# Altium schematic sheet WiFi.SchDoc
size A4
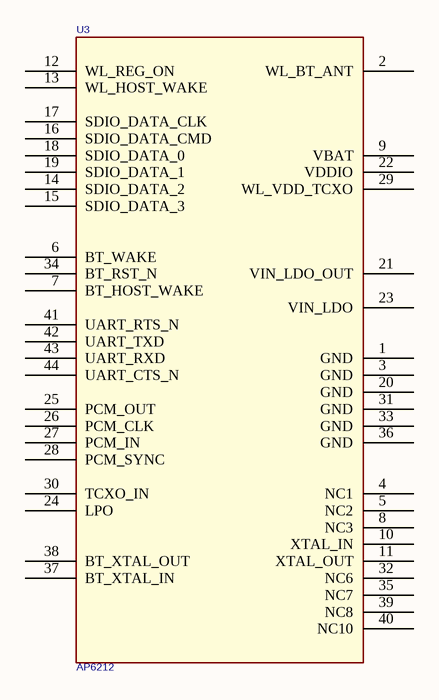
[diagram p0: WiFi.SchDoc]

## Parts
U3  AP6212  [AP6212]

## Nets

Not connected (* = marked no-connect by the designer): U3 1(GND) 2(WL_BT_ANT) 3(GND) 4(NC1) 5(NC2) 6(BT_WAKE) 7(BT_HOST_WAKE) 8(NC3) 9(VBAT) 10(XTAL_IN) 11(XTAL_OUT) 12(WL_REG_ON) 13(WL_HOST_WAKE) 14(SDIO_DATA_2) 15(SDIO_DATA_3) 16(SDIO_DATA_CMD) 17(SDIO_DATA_CLK) 18(SDIO_DATA_0) 19(SDIO_DATA_1) 20(GND) 21(VIN_LDO_OUT) 22(VDDIO) 23(VIN_LDO) 24(LPO) 25(PCM_OUT) 26(PCM_CLK) 27(PCM_IN) 28(PCM_SYNC) 29(WL_VDD_TCXO) 30(TCXO_IN) 31(GND) 32(NC6) 33(GND) 34(BT_RST_N) 35(NC7) 36(GND) 37(BT_XTAL_IN) 38(BT_XTAL_OUT) 39(NC8) 40(NC10) 41(UART_RTS_N) 42(UART_TXD) 43(UART_RXD) 44(UART_CTS_N)

## Library data of the parts
U3 = AP6212: ORCAD_LIB: MODULE; QVL: AMPAK; Device: APSERIES